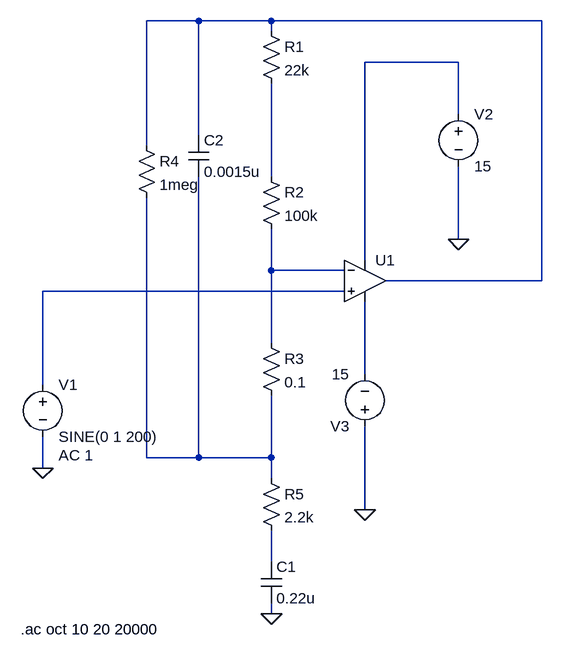
[diagram p0: schematic MD-2 GAIN BOOST.asc]
MD-2 GAIN BOOST.asc, the LTspice schematic file:
Version 4
SHEET 1 880 680
WIRE -368 -288 -448 -288
WIRE -256 -288 -368 -288
WIRE 160 -288 -256 -288
WIRE -256 -272 -256 -288
WIRE 32 -224 -112 -224
WIRE 32 -144 32 -224
WIRE -368 -112 -368 -288
WIRE -448 -96 -448 -288
WIRE -256 -48 -256 -192
WIRE 32 48 32 -64
WIRE -112 80 -112 -224
WIRE -256 96 -256 32
WIRE -144 96 -256 96
WIRE 160 112 160 -288
WIRE 160 112 -80 112
WIRE -144 128 -608 128
WIRE -256 208 -256 96
WIRE -112 256 -112 144
WIRE -608 272 -608 128
WIRE -448 384 -448 -16
WIRE -368 384 -368 -48
WIRE -368 384 -448 384
WIRE -256 384 -256 288
WIRE -256 384 -368 384
WIRE -608 400 -608 352
WIRE -256 416 -256 384
WIRE -112 464 -112 336
WIRE -256 544 -256 496
WIRE -256 624 -256 608
FLAG -256 624 0
FLAG -608 400 0
FLAG -112 464 0
FLAG 32 48 0
SYMBOL voltage -608 256 R0
WINDOW 123 24 124 Left 2
WINDOW 39 0 0 Left 2
SYMATTR InstName V1
SYMATTR Value SINE(0 1 200)
SYMATTR Value2 AC 1
SYMBOL cap -272 544 R0
SYMATTR InstName C1
SYMATTR Value 0.22u
SYMBOL res -272 -288 R0
SYMATTR InstName R1
SYMATTR Value 22k
SYMBOL res -272 -64 R0
SYMATTR InstName R2
SYMATTR Value 100k
SYMBOL res -272 192 R0
SYMATTR InstName R3
SYMATTR Value 0.1
SYMBOL res -464 -112 R0
SYMATTR InstName R4
SYMATTR Value 1meg
SYMBOL res -272 400 R0
SYMATTR InstName R5
SYMATTR Value 2.2k
SYMBOL cap -384 -112 R0
SYMATTR InstName C2
SYMATTR Value 0.0015u
SYMBOL voltage 32 -160 R0
WINDOW 123 0 0 Left 2
WINDOW 39 0 0 Left 2
SYMATTR InstName V2
SYMATTR Value 15
SYMBOL voltage -112 352 R180
WINDOW 123 0 0 Left 2
WINDOW 39 0 0 Left 2
SYMATTR InstName V3
SYMATTR Value 15
SYMBOL Opamps\\UniversalOpamp2 -112 112 R0
SYMATTR InstName U1
TEXT -642 648 Left 2 !.ac oct 10 20 20000

The netlist it stands for:
* MD-2 GAIN BOOST.asc
V1 N005 0 SINE(0 1 200) AC 1
C1 N008 0 0.22u
R1 N001 N003 22k
R2 N003 N004 100k
R3 N004 N007 0.1
R4 N001 N007 1meg
R5 N007 N008 2.2k
C2 N001 N007 0.0015u
V2 N002 0 15
V3 0 N006 15
XU1 N005 N004 N002 N006 N001 level.2 Avol=1Meg GBW=10Meg Slew=10Meg ilimit=25m rail=0 Vos=0 phimargin=45 en=0 enk=0 in=0 ink=0 Rin=500Meg  ; pins IN+ IN- V+ V- OUT
.ac oct 10 20 20000
.lib UniversalOpamps2.sub
.backanno
.end